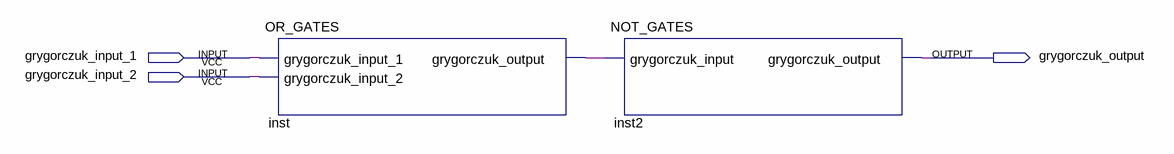
[diagram p0: schematic sheet]
// Quartus schematic NOR_GATES.bdf as structural Verilog: 2 symbols, 3 pins
module NOR_GATES (
  input  grygorczuk_input_1,
  input  grygorczuk_input_2,
  output grygorczuk_output
);

  wire inst_grygorczuk_output;

  OR_GATES inst (
    .grygorczuk_input_1(grygorczuk_input_1), .grygorczuk_input_2(grygorczuk_input_2),
    .grygorczuk_output(inst_grygorczuk_output));
  NOT_GATES inst2 (.grygorczuk_input(inst_grygorczuk_output), .grygorczuk_output(grygorczuk_output));
endmodule
